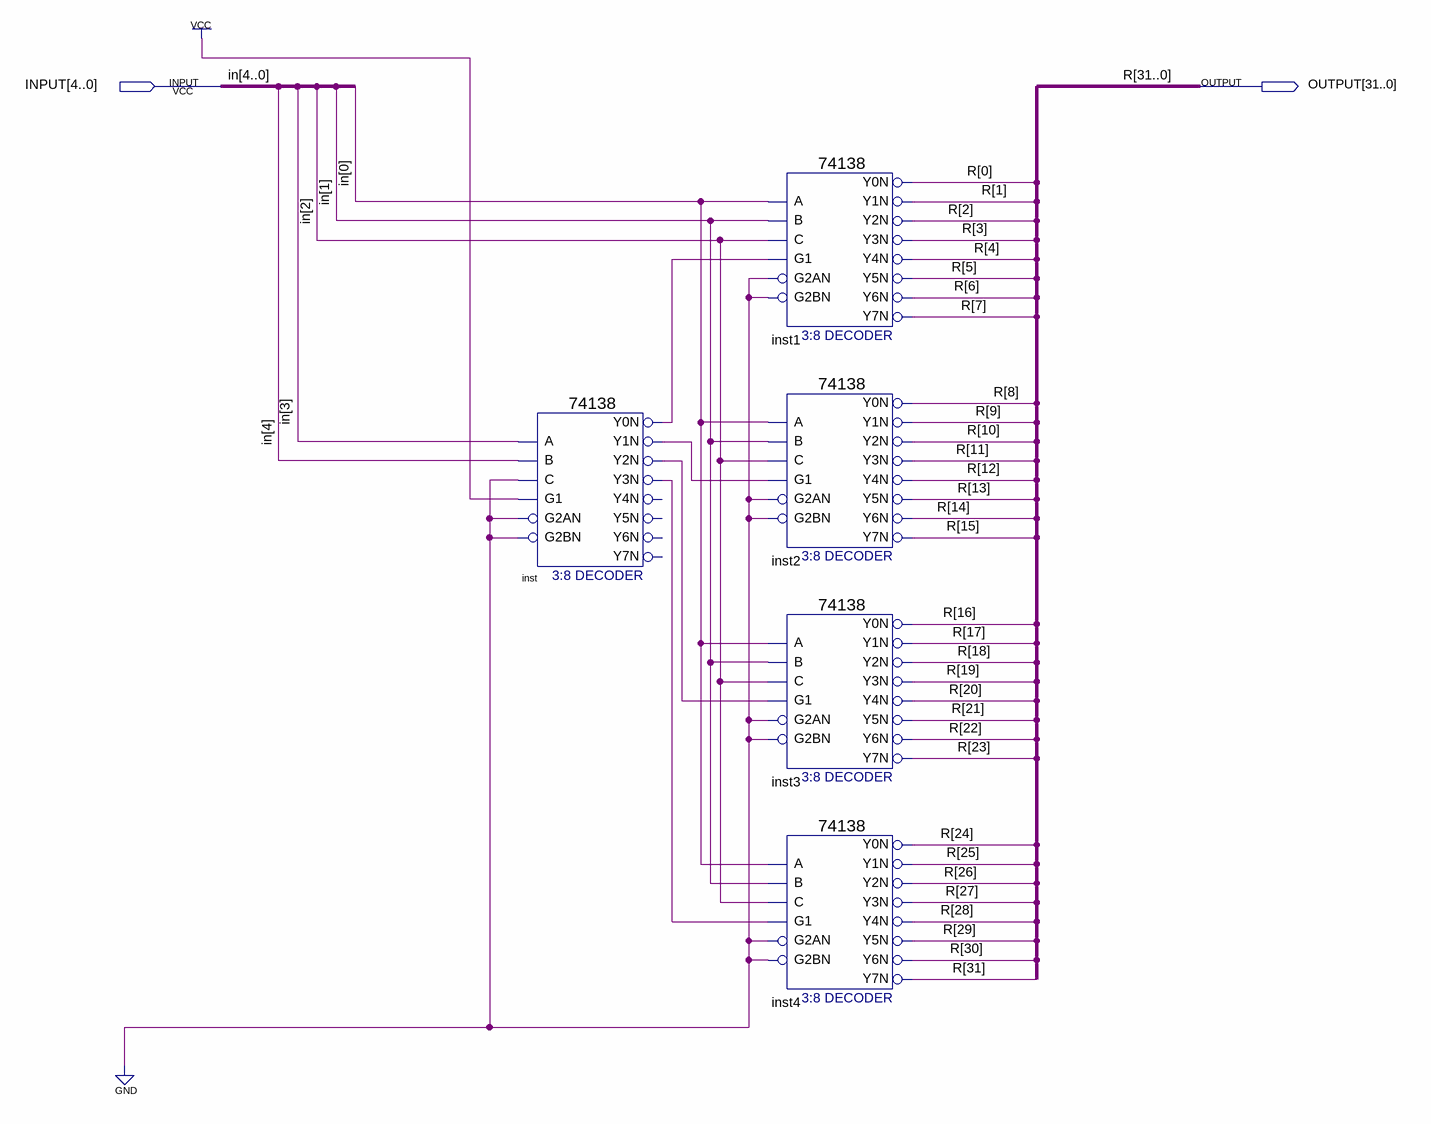
[diagram p0: schematic sheet]
// Quartus schematic 5-32Decoder.bdf as structural Verilog: 5 symbols, 2 pins
module \5-32Decoder  (
  input  [4:0] INPUT,
  output [31:0] OUTPUT
);

  wire inst_y0n, inst_y1n, inst_y2n, inst_y3n;

  \74138  inst (
    .A(INPUT[3]), .B(INPUT[4]), .G1(1'b1), .C(1'b0), .G2AN(1'b0), .G2BN(1'b0), .Y0N(inst_y0n),
    .Y1N(inst_y1n), .Y2N(inst_y2n), .Y3N(inst_y3n));  // open: Y4N, Y5N, Y6N, Y7N
  \74138  inst1 (
    .A(INPUT[0]), .B(INPUT[1]), .G1(inst_y0n), .C(INPUT[2]), .G2AN(1'b0), .G2BN(1'b0), .Y0N(OUTPUT[0]),
    .Y1N(OUTPUT[1]), .Y2N(OUTPUT[2]), .Y3N(OUTPUT[3]), .Y4N(OUTPUT[4]), .Y5N(OUTPUT[5]), .Y6N(OUTPUT[6]),
    .Y7N(OUTPUT[7]));
  \74138  inst2 (
    .A(INPUT[0]), .B(INPUT[1]), .G1(inst_y1n), .C(INPUT[2]), .G2AN(1'b0), .G2BN(1'b0), .Y0N(OUTPUT[8]),
    .Y1N(OUTPUT[9]), .Y2N(OUTPUT[10]), .Y3N(OUTPUT[11]), .Y4N(OUTPUT[12]), .Y5N(OUTPUT[13]),
    .Y6N(OUTPUT[14]), .Y7N(OUTPUT[15]));
  \74138  inst3 (
    .A(INPUT[0]), .B(INPUT[1]), .G1(inst_y2n), .C(INPUT[2]), .G2AN(1'b0), .G2BN(1'b0), .Y0N(OUTPUT[16]),
    .Y1N(OUTPUT[17]), .Y2N(OUTPUT[18]), .Y3N(OUTPUT[19]), .Y4N(OUTPUT[20]), .Y5N(OUTPUT[21]),
    .Y6N(OUTPUT[22]), .Y7N(OUTPUT[23]));
  \74138  inst4 (
    .A(INPUT[0]), .B(INPUT[1]), .G1(inst_y3n), .C(INPUT[2]), .G2AN(1'b0), .G2BN(1'b0), .Y0N(OUTPUT[24]),
    .Y1N(OUTPUT[25]), .Y2N(OUTPUT[26]), .Y3N(OUTPUT[27]), .Y4N(OUTPUT[28]), .Y5N(OUTPUT[29]),
    .Y6N(OUTPUT[30]), .Y7N(OUTPUT[31]));

  // Other names for the same wires on the sheet: in[4:0] = INPUT; R[31:0] = OUTPUT
endmodule
